# EAGLE design ASD2301 (EAGLE 6.4)
DATABASE: ./../../../../../Components/TinyCircuits_Part_Database.txt
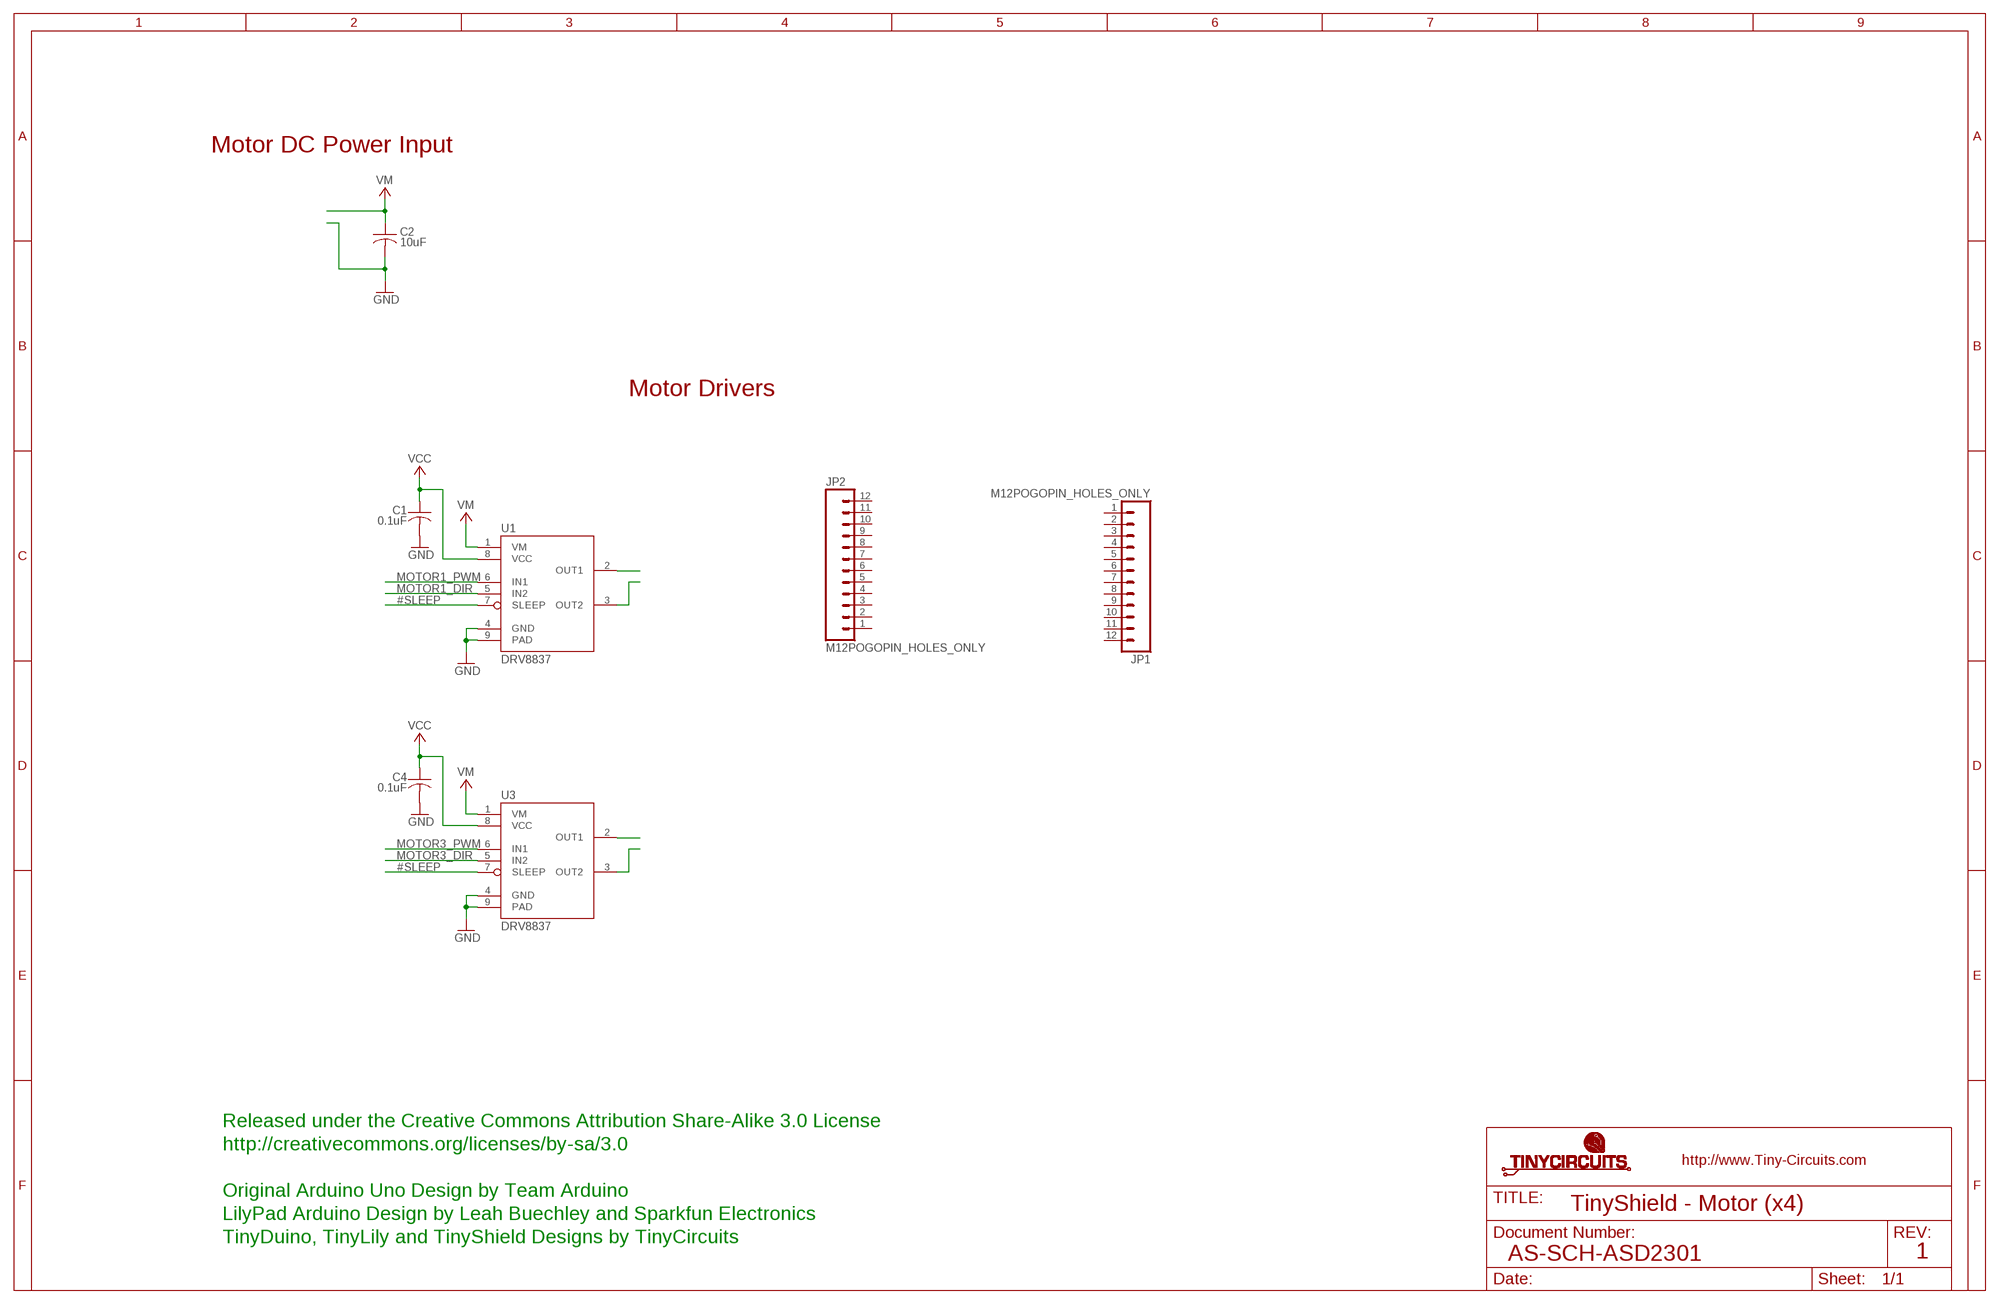
[diagram p0: schematic, sheet 1]

## Parts
C1  0.1uF  AS-ITM-00008  [C0402]
C2  10uF  AS-ITM-00045  [C0805]
C4  0.1uF  AS-ITM-00008  [C0402]
JP1  M12POGOPIN_HOLES_ONLY  [1X12_HOLES_ONLY]
JP2  M12POGOPIN_HOLES_ONLY  [1X12_HOLES_ONLY]
U1  DRV8837  AS-ITM-00042  [WSON-8]
U3  DRV8837  AS-ITM-00042  [WSON-8]

## Nets
#SLEEP: U1.7(SLEEP) U3.7(SLEEP)
GND: C1.2 C2.2 C4.2 U1.4(GND) U1.9(PAD) U3.4(GND) U3.9(PAD)
MOTOR1_DIR: U1.5(IN2)
MOTOR1_PWM: U1.6(IN1)
MOTOR3_DIR: U3.5(IN2)
MOTOR3_PWM: U3.6(IN1)
N$1: U1.2(OUT1)
N$2: U1.3(OUT2)
N$5: U3.2(OUT1)
N$6: U3.3(OUT2)
VCC: C1.1 C4.1 U1.8(VCC) U3.8(VCC)
VM: C2.1 U1.1(VM) U3.1(VM)
Unconnected: JP1.1 JP1.2 JP1.3 JP1.4 JP1.5 JP1.6 JP1.7 JP1.8 JP1.9 JP1.10 JP1.11 JP1.12 JP2.1 JP2.2 JP2.3 JP2.4 JP2.5 JP2.6 JP2.7 JP2.8 JP2.9 JP2.10 JP2.11 JP2.12

## Notes on the sheet
- Motor DC Power Input
- Motor Drivers
- Released under the Creative Commons Attribution Share-Alike 3.0 License
- http://creativecommons.org/licenses/by-sa/3.0
- Original Arduino Uno Design by Team Arduino
- TinyShield - Motor (x4)
- LilyPad Arduino Design by Leah Buechley and Sparkfun Electronics
- TinyDuino, TinyLily and TinyShield Designs by TinyCircuits
- AS-SCH-ASD2301 | 1

## Library data of the parts
C1 C4 = tinycircuits:AS-ITM-00008: CAP CER 0.1UF 16V 10% X5R 0402; PARTNO: AS-ITM-00008
C2 = tinycircuits:AS-ITM-00045: CAP CER 16UF 16V 20% X5R 0805; PARTNO: AS-ITM-00045
JP1 JP2 = SparkFun:M12: Header 12 Standard 12-pin 0.1" header. Use with straight break away headers (SKU : PRT-00116), right angle break away headers (PRT-00553), swiss pins (PRT-00743), machine pins (PRT-00117), and female headers (PRT-00115).
U1 U3 = tinycircuits:AS-ITM-00042: IC PWM MOTR DVR H-BRDG 8WSON; PARTNO: AS-ITM-00042

## Board
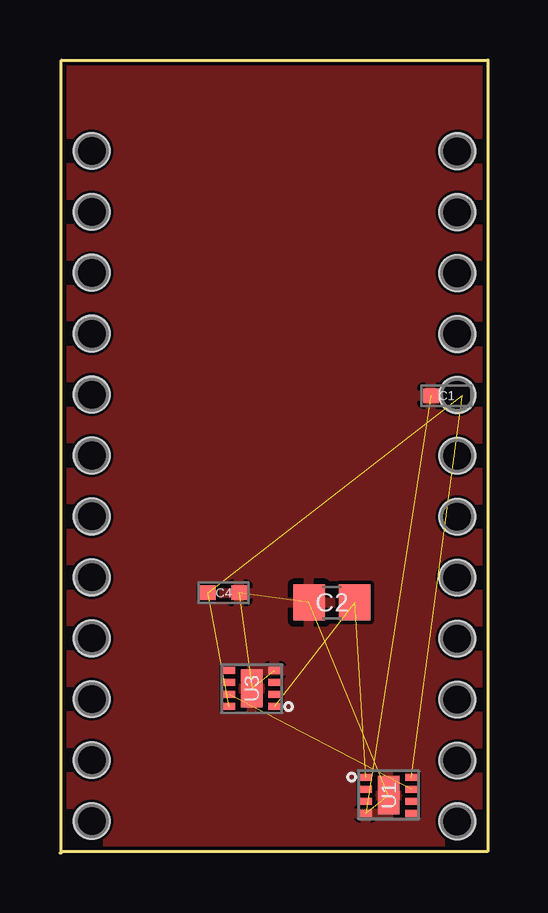
[diagram p1: board, top side]
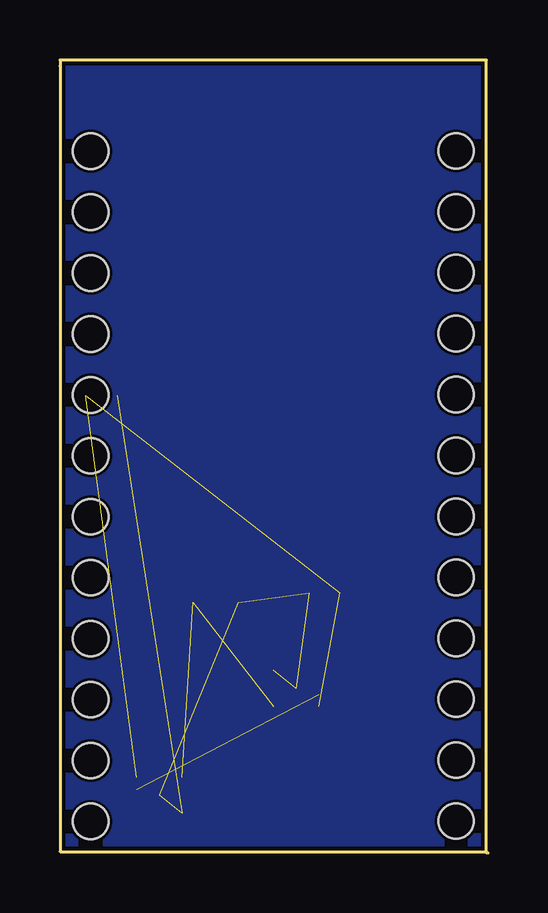
[diagram p2: board, bottom side, seen from below]

Size 17.85 x 33.06 mm. Coordinates in mm from the lower left corner, seen from the top.
Outline: 0,0 0.06,0 0.06,33.06 17.85,33.06 17.85,32.8 17.84,32.8 17.84,0.06 0.06,0.06 0.06,0.05
Copper layers (1*16): Top 0.035mm / dielectric 1.5mm / Bottom 0.035mm
Design rules "default *": minimum track width 8mil, minimum drill 15mil, track to track 6mil, track to pad 6mil, pad to pad 6mil, via to via 6mil, smd to smd 6mil, copper to edge 6mil, drill to drill 8mil, minimum pad ring 10mil, minimum via ring 5mil, stop-mask expansion 4mil, vias tented up to drill 25mil, thermal gap 10mil

### Footprints (pad centres in the part's own frame; a part is rotated, then mirrored left to right if it is on the bottom)
C0402 = smd 0.65 x 0.6: 1 -0.65,0; 2 0.65,0
C0805 = smd 1.3 x 1.5: 1 -0.95,0; 2 0.95,0
1X12_HOLES_ONLY = drill 0.889 pad 0.813: 1 0,0; 2 2.54,0; 3 5.08,0; 4 7.62,0; 5 10.16,0; 6 12.7,0; 7 15.24,0; 8 17.78,0; 9 20.32,0; 10 22.86,0; 11 25.4,0; 12 27.94,0 | hole 1.473: 0,0; 2.54,0; 5.08,0; 7.62,0; 10.16,0; 12.7,0; 15.24,0; 17.78,0; 20.32,0; 22.86,0; 25.4,0; 27.94,0
WSON-8 = smd 0.28 x 0.5: 1 -0.75,-0.95; 2 -0.25,-0.95; 3 0.25,-0.95; 4 0.75,-0.95; 5 0.75,0.95; 6 0.25,0.95; 7 -0.25,0.95; 8 -0.75,0.95 | smd 1.6 x 0.9: 9 0,0

### Placement (x,y rotation side)
C1  16.12,19.07 180 top
C2  11.34,10.44 180 top
C4  6.82,10.85 0 top
JP1  1.33,1.33 90 top
JP2  16.57,1.32 90 top
U1  13.7,2.41 270 top
U3  8,6.86 90 top

### Tracks (layer width: path | path; a pad name or v marks a point on that pad's centre or on a via)
#SLEEP  (1 unrouted)
GND  (6 unrouted)
  pour Bottom: 0,0 0,33.02 17.78,33.02 17.78,0
  pour Top: 0,0 0,33.02 17.78,33.02 17.78,0
VCC  (3 unrouted)
VM  (2 unrouted)

### Text on the board
tPlace: VM | GND | MOTOR1 | MOTOR2
bPlace: VM | GND | MOTOR1 | MOTOR2